# EAGLE design Bandage FPC (EAGLE 6.6.0)
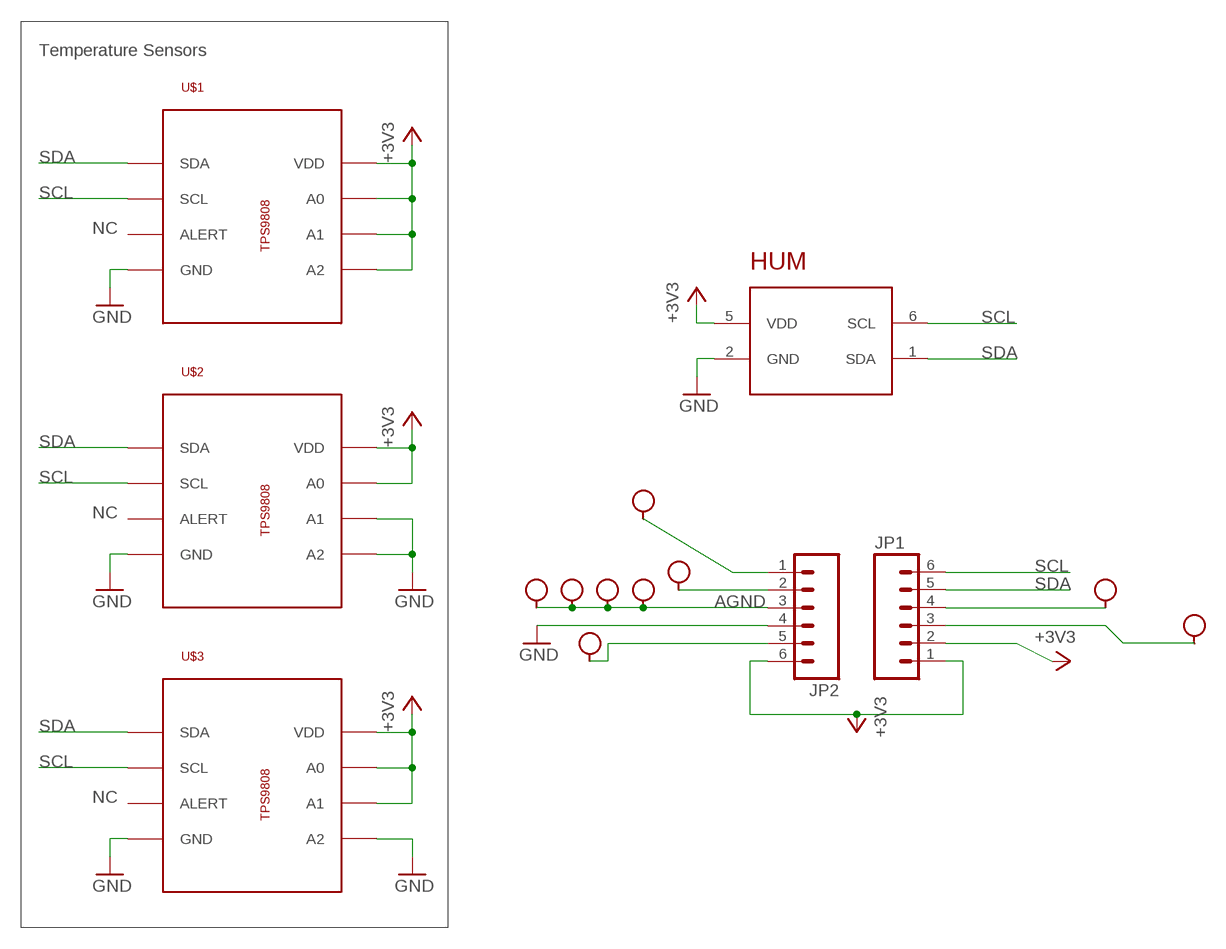
[diagram p0: schematic, sheet 1]

## Parts
H1  SEW_HOLE-SMALL  [SIMPLE_HOLE_SM]
H2  SEW_HOLE-SMALL  [SIMPLE_HOLE_SM]
H3  SEW_HOLE-SMALL  [SIMPLE_HOLE_SM]
H4  SEW_HOLE-SMALL  [SIMPLE_HOLE_SM]
H5  SEW_HOLE-SMALL  [SIMPLE_HOLE_SM]
H6  SEW_HOLE-SMALL  [SIMPLE_HOLE_SM]
H7  SEW_HOLE-SMALL  [SIMPLE_HOLE_SM]
H8  SEW_HOLE-SMALL  [SIMPLE_HOLE_SM]
H9  SEW_HOLE-SMALL  [SIMPLE_HOLE_SM]
HUM  HDC1050  [SON-6]
JP1  M06LOCK  [1X06_LOCK]
JP2  M06LOCK  [1X06_LOCK]
U$1  MCP9808  [MSOP8]
U$2  MCP9808  [MSOP8]
U$3  MCP9808  [MSOP8]

## Nets
+3V3: HUM.5(VDD) JP1.1 JP1.2 JP2.6 U$1.5(A2) U$1.6(A1) U$1.7(A0) U$1.8(VDD) U$2.7(A0) U$2.8(VDD) U$3.6(A1) U$3.7(A0) U$3.8(VDD)
AGND: H6.P$1 H7.P$1 H8.P$1 H9.P$1 JP2.3
GND: HUM.2(GND) JP2.4 U$1.4(GND) U$2.4(GND) U$2.5(A2) U$2.6(A1) U$3.4(GND) U$3.5(A2)
N$1: H2.P$1 JP1.3
N$2: H1.P$1 JP2.5
N$3: H4.P$1 JP2.2
N$4: H3.P$1 JP1.4
N$5: H5.P$1 JP2.1
SCL: HUM.6(SCL) JP1.6 U$1.2(SCL) U$2.2(SCL) U$3.2(SCL)
SDA: HUM.1(SDA) JP1.5 U$1.1(SDA) U$2.1(SDA) U$3.1(SDA)
Unconnected: U$1.3(ALERT) U$2.3(ALERT) U$3.3(ALERT)

## Notes on the sheet
- Temperature Sensors
- NC
- NC
- NC

## Library data of the parts
H1-H9 = LilyPad-Wearables:SEW_HOLE-SMALL: .070" hole with 20mil annular ring
HUM = Capstone Library:HDC1050
JP1 JP2 = SparkFun-Connectors:M06: Header 6 Standard 6-pin 0.1" header. Use with straight break away headers (SKU : PRT-00116), right angle break away headers (PRT-00553), swiss pins (PRT-00743), machine pins (PRT-00117), and female headers (PRT-00115). Molex polarized connector foot print use with SKU : PRT-08094 with associated crimp pins and housings. NOTES ON THE VARIANTS LOCK and LOCK_LONGPADS... This footprint was designed to help hold the alignment of a through-hole component (i.e. 6-pin header) while soldering it into place. You may notice that each hole has been shifted either up or down by 0.005 of an inch from it's more standard position (which is a perfectly straight line). This slight alteration caused the pins (the squares in the middle) to touch the edges of the holes. Because they are alternating, it causes a "brace" to hold the component in place. 0.005 has proven to be the perfect amount of "off-center" position when using our standard breakaway headers. Although looks a little odd when you look at the bare footprint, once you have a header in there, the alteration is very hard to notice. Also,if you push a header all the way into place, it is covered up entirely on the bottom side. This idea of altering the position of holes to aid alignment will be further integrated into the Sparkfun Library for other footprints. It can help hold any component with 3 or more connection pins.
U$1-U$3 = Michael Blouin Library:MCP9808: MCP9808 Maximum Accuracy Digital Temperature Sensor

## Board
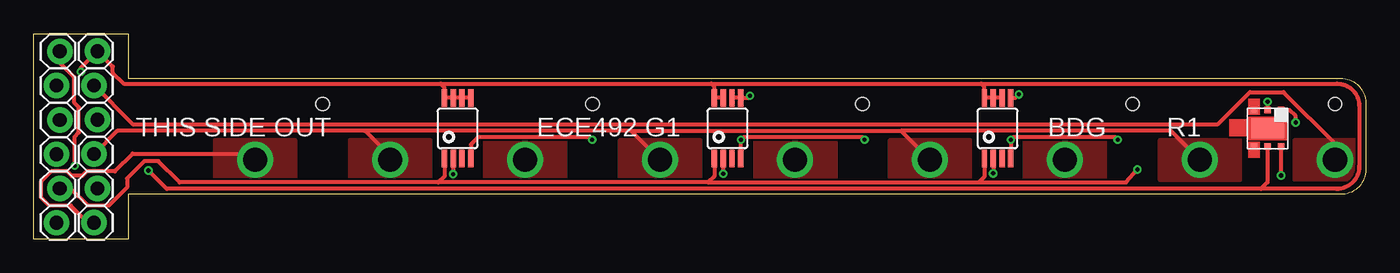
[diagram p1: board, top side]
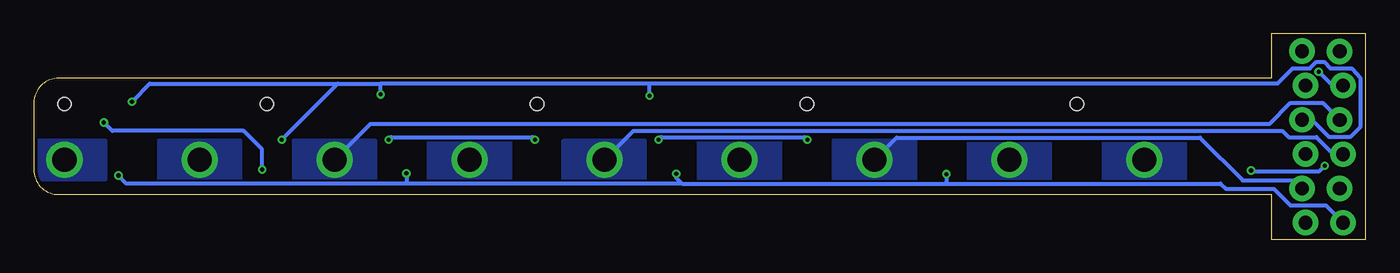
[diagram p2: board, bottom side, seen from below]

Size 98.68 x 15.2 mm. Coordinates in mm from the lower left corner, seen from the top.
Outline: 6.99,2.04 6.99,3.3 96.97,3.3 arc90 98.67,5.31 98.67,10.1 arc90 96.82,11.91 6.99,11.91 6.99,15.2 0,15.2 0,0 6.99,0 6.99,2.04
Copper layers (1*16): Top 0.035mm / dielectric 1.5mm / Bottom 0.035mm
Design rules "SeeedStudio_2layer_DRU_no_angle_20140221": minimum track width 6mil, minimum drill 12mil, track to track 6mil, track to pad 6mil, pad to pad 6mil, via to via 6mil, smd to smd 0mil, copper to edge 10mil, drill to drill 10mil, minimum pad ring 10mil, minimum via ring 6mil, stop-mask expansion 2mil, vias tented up to drill 100mil, thermal gap 10mil
Holes 1 mm at 21.4,9.99 41.4,9.99 61.4,9.99 81.4,9.99 96.4,9.99

### Footprints (pad centres in the part's own frame; a part is rotated, then mirrored left to right if it is on the bottom)
SIMPLE_HOLE_SM = drill 1.778 pad 2.286: P$1 0,0
SON-6 = smd 0.45 x 0.5: 1 -1,-1.35; 2 0,-1.35; 3 1,-1.35; 4 1,1.35; 5 0,1.35; 6 -1,1.35 | smd 2.4 x 1.5: PAD 0,0
1X06_LOCK = drill 1.016 pad 1.88: 1 0,0; 2 2.54,-0.254; 3 5.08,0; 4 7.62,-0.254; 5 10.16,0; 6 12.7,-0.254
MSOP8 = smd 0.4 x 1.3: 1 -0.975,-2.25; 2 -0.325,-2.25; 3 0.325,-2.25; 4 0.975,-2.25; 5 0.975,2.25; 6 0.325,2.25; 7 -0.325,2.25; 8 -0.975,2.25

### Placement (x,y rotation side)
H1  96.4,5.86 270 top
H2  76.4,5.86 270 top
H3  56.4,5.86 270 top
H4  36.4,5.86 270 top
H5  16.4,5.86 270 top
H6  26.4,5.86 0 top
H7  46.4,5.86 0 top
H8  66.4,5.86 0 top
H9  86.4,5.86 0 top
HUM  91.4,8.2 180 top
JP1  1.93,13.9 270 top
JP2  4.47,1.21 90 top
U$1  31.4,8.2 0 top
U$2  51.4,8.2 0 top
U$3  71.4,8.2 0 top

### Tracks (layer width: path | path; a pad name or v marks a point on that pad's centre or on a via)
+3V3  (via drill 0.3)
  Top 0.305: U$3.6 U$3.7 U$3.8 70.42,11.26 70.19,11.5 | U$2.7 U$2.8 50.42,11.27 50.2,11.5 | 30.14,11.5 6.65,11.5 5.86,12.29 5.86,12.77 JP2.6 3.49,12.68 v3.49,12.39 | 30.14,11.5 50.2,11.5 | 50.2,11.5 70.19,11.5 | 70.19,11.5 96.55,11.5 arc-90 98.19,9.87 98.19,5.39 arc-90 98.19,5.37 arc-90 96.52,3.71 90.91,3.71 | v3.03,5.42 3.03,7.57 3.35,7.89 3.35,9.75 3.01,10.09 3.01,11.99 1.93,13.07 JP1.1 | 90.91,3.71 9.86,3.71 v8.5,5.07 | HUM.5 91.4,4.2 90.91,3.71 | 30.14,11.5 30.43,11.21 U$1.8 U$1.7 U$1.6 U$1.5
  Bottom 0.305: v8.5,5.07 8.45,5.02 3.43,5.02 v3.03,5.42 | JP1.2 2.46,11.36 v3.49,12.39
AGND
  Top 0.305: H9.P$1 84.25,8.01 64.25,8.01 | 44.25,8.01 H7.P$1 | 44.25,8.01 64.25,8.01 | 64.25,8.01 H8.P$1 | JP2.3 6.19,8.01 24.54,8.01 | 44.25,8.01 24.54,8.01 | H6.P$1 26.4,6.15 24.54,8.01
  pour Top (no thermals): 29.4,7.31 23.4,7.31 23.4,4.38 29.4,4.38
  pour Bottom (no thermals): 29.4,7.31 23.4,7.31 23.4,4.4 29.4,4.4
  pour Top (no thermals): 49.4,7.31 43.4,7.31 43.4,4.4 49.4,4.4
  pour Bottom (no thermals): 49.4,7.31 43.4,7.31 43.4,4.4 49.4,4.4
  pour Bottom (no thermals): 69.4,7.31 63.4,7.31 63.4,4.4 69.4,4.4
  pour Top (no thermals): 69.4,7.31 63.4,7.31 63.4,4.4 69.4,4.4
  pour Top (no thermals): 89.4,7.31 83.4,7.31 83.4,4.4 89.4,4.4
  pour Bottom (no thermals): 89.4,7.31 83.4,7.31 83.4,4.4 89.4,4.4
GND  (via drill 0.3)
  Top 0.305: U$2.6 U$2.5 52.9,10.45 v53.06,10.61 | v91.4,10.17 HUM.2 | v41.37,7.36 41.18,7.55 32.93,7.55 32.38,7 U$1.4 | v61.55,7.36 61.36,7.55 52.58,7.55 v52.38,7.35 U$2.4 | v72.39,7.36 72.58,7.55 80.11,7.55 v80.3,7.35 | v72.39,7.36 72.39,5.97 U$3.4 | v72.39,7.36 v72.39,7.35 | U$3.5 72.72,10.45 v72.98,10.71
  Bottom 0.305: 53.05,11.5 6.55,11.5 5.42,12.63 4.13,12.63 3.65,13.11 3.08,13.11 2.61,12.64 1.05,12.64 1.01,12.6 0.41,11.95 0.41,8.29 1.15,7.55 2.71,7.55 4.01,8.85 4.7,8.85 JP2.4 | 53.05,11.5 72.97,11.5 | v91.4,10.17 90.07,11.5 76.16,11.5 | 76.16,11.5 72.97,11.5 | v41.37,7.36 41.56,7.55 52.19,7.55 v52.38,7.35 | v61.55,7.36 61.74,7.55 72.2,7.55 v72.39,7.35 | v53.06,10.61 53.06,11.49 53.05,11.5 | v72.98,10.71 72.98,11.49 72.97,11.5 | 76.16,11.5 v80.3,7.35
N$1
  Bottom 0.305: H2.P$1 73.75,8.51 7.16,8.51 5.58,10.09 3.2,10.09 JP1.3
  pour Top (no thermals): 79.4,7.31 73.4,7.31 73.4,4.4 79.4,4.4
  pour Bottom (no thermals): 79.4,7.31 73.4,7.31 73.4,4.4 79.4,4.4
N$2
  Top 0.305: 96.35,5.81 H1.P$1 96.4,7.04 92.57,10.87 90.09,10.87 87.73,8.51 7.33,8.51 JP2.5
  pour Bottom (no thermals): 99.4,7.31 93.4,7.31 93.4,4.4 99.4,4.4
  pour Top (no thermals): 99.43,7.31 93.4,7.31 93.4,4.41 99.43,4.41
N$3
  Bottom 0.305: H4.P$1 34.75,7.51 12.28,7.51 9.12,4.35 5.32,4.35 JP2.2
  pour Top (no thermals): 39.4,7.31 33.4,7.31 33.4,4.4 39.4,4.4
  pour Bottom (no thermals): 39.4,7.31 33.4,7.31 33.4,4.4 39.4,4.4
N$4
  Bottom 0.305: H3.P$1 54.25,8.01 6.19,8.01 5.72,7.54 3.66,7.54 2.43,6.31 1.81,6.31 1.78,6.28 JP1.4
  pour Bottom (no thermals): 59.42,7.31 53.42,7.31 53.42,4.4 59.42,4.4
  pour Top (no thermals): 59.44,7.31 53.44,7.31 53.44,4.4 59.44,4.4
N$5
  Top 0.305: 0.53,4.26 0.53,4.24 | JP2.1 4,1.21 2.74,2.47 1.14,2.47 0.53,3.08 0.53,4.01 0.53,4.24 | H5.P$1 15.93,6.33 7.33,6.33 6.01,5.01 3.92,5.01 3.59,4.68 2.8,4.68 2.47,5.01 1.3,5.01 0.53,4.24
  pour Bottom (no thermals): 19.4,7.31 13.4,7.31 13.4,4.4 19.4,4.4
  pour Top (no thermals): 19.4,7.31 13.4,7.31 13.4,4.4 19.4,4.4
SCL  (via drill 0.3)
  Top 0.305: U$2.2 v51.08,4.83 | HUM.6 v92.4,4.7 | U$1.2 31.07,4.79 v31.07,4.81 | U$3.2 v71.08,4.87 v71.07,4.86
  Bottom 0.305: JP1.6 1.68,1.23 2.93,2.48 5.57,2.48 6.8,3.71 10.36,3.71 10.76,4.11 30.98,4.11 | 50.67,4.11 70.97,4.11 | 70.97,4.11 91.81,4.11 v92.4,4.7 | 50.67,4.11 30.98,4.11 | v51.08,4.83 51.08,4.52 50.67,4.11 | v31.07,4.81 31.07,4.2 30.98,4.11 | v71.07,4.86 71.07,4.21 70.97,4.11
SDA  (via drill 0.3)
  Top 0.305: JP1.5 2.73,3.74 3.98,2.49 5.59,2.49 6.92,3.82 6.92,4.49 8.2,5.77 9.22,5.77 10.8,4.19 29.97,4.19 | 49.95,4.19 70.02,4.19 | 70.02,4.19 80.92,4.19 v81.76,5.15 | 49.95,4.19 29.97,4.19 | U$2.1 50.42,4.67 49.95,4.19 | U$1.1 30.43,4.65 29.97,4.19 | U$3.1 70.42,4.6 70.02,4.19 | v93.48,8.63 93.48,9.11 93.04,9.55 HUM.1
  Bottom 0.305: v81.76,5.15 81.76,6.64 83.13,8.01 92.86,8.01 v93.48,8.63
(copper drawn outside any net)
  shapes: Top area x4

### Text on the board
tPlace: THIS SIDE OUT | ECE492 G1 | BDG | R1